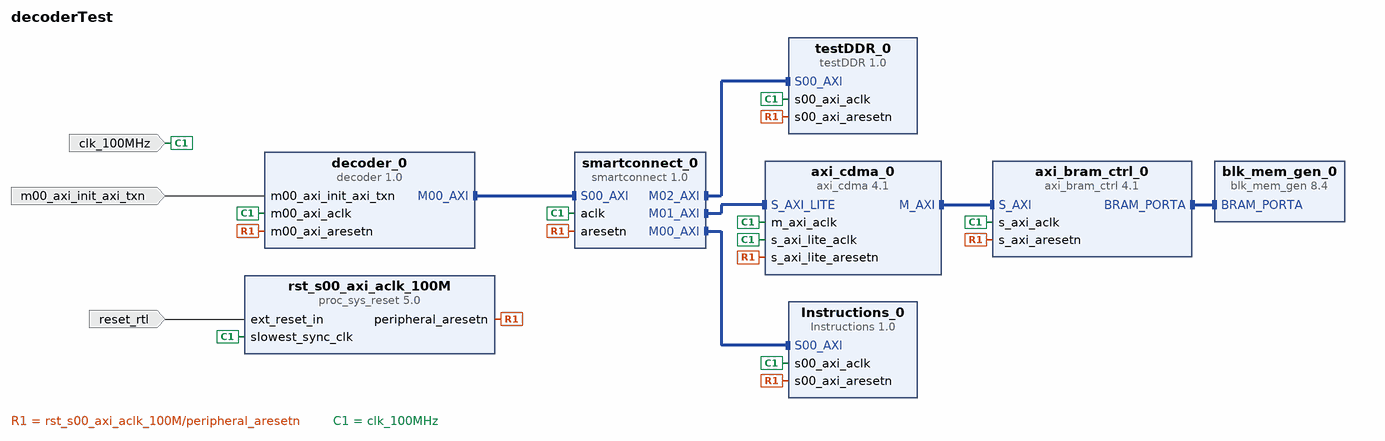
[diagram p0: block diagram of the top level]
# Vivado block design decoderTest, xc7z020clg400-1, Vivado 2018.3
create_bd_design decoderTest

create_bd_port -dir I -type rst reset_rtl
set_property -dict {CONFIG.POLARITY ACTIVE_LOW} [get_bd_ports reset_rtl]
create_bd_port -dir I m00_axi_init_axi_txn
create_bd_port -dir I -type clk clk_100MHz
set_property -dict {CONFIG.FREQ_HZ 100000000} [get_bd_ports clk_100MHz]

create_bd_cell -type ip -vlnv xilinx.com:ip:proc_sys_reset:5.0 rst_s00_axi_aclk_100M
create_bd_cell -type ip -vlnv xilinx.com:ip:axi_cdma:4.1 axi_cdma_0
set_property -dict {CONFIG.C_INCLUDE_SG 0} [get_bd_cells axi_cdma_0]
create_bd_cell -type ip -vlnv xilinx.com:ip:smartconnect:1.0 smartconnect_0
set_property -dict {CONFIG.NUM_MI 3 CONFIG.NUM_SI 1} [get_bd_cells smartconnect_0]
create_bd_cell -type ip -vlnv xilinx.com:ip:axi_bram_ctrl:4.1 axi_bram_ctrl_0
set_property -dict {CONFIG.SINGLE_PORT_BRAM 1} [get_bd_cells axi_bram_ctrl_0]
create_bd_cell -type ip -vlnv xilinx.com:ip:blk_mem_gen:8.4 blk_mem_gen_0
create_bd_cell -type ip -vlnv xilinx.com:user:Instructions:1.0 Instructions_0
create_bd_cell -type ip -vlnv xilinx.com:user:decoder:1.0 decoder_0
set_property -dict {CONFIG.C_M00_AXI_TRANSACTIONS_NUM 4} [get_bd_cells decoder_0]
create_bd_cell -type ip -vlnv xilinx.com:user:testDDR:1.0 testDDR_0

# ---- connections ----

connect_bd_intf_net [get_bd_intf_pins smartconnect_0/M02_AXI] [get_bd_intf_pins testDDR_0/S00_AXI]
connect_bd_intf_net [get_bd_intf_pins axi_bram_ctrl_0/BRAM_PORTA] [get_bd_intf_pins blk_mem_gen_0/BRAM_PORTA]
connect_bd_intf_net [get_bd_intf_pins decoder_0/M00_AXI] [get_bd_intf_pins smartconnect_0/S00_AXI]
connect_bd_intf_net [get_bd_intf_pins smartconnect_0/M00_AXI] [get_bd_intf_pins Instructions_0/S00_AXI]
connect_bd_intf_net [get_bd_intf_pins axi_cdma_0/M_AXI] [get_bd_intf_pins axi_bram_ctrl_0/S_AXI]
connect_bd_intf_net [get_bd_intf_pins axi_cdma_0/S_AXI_LITE] [get_bd_intf_pins smartconnect_0/M01_AXI]
connect_bd_net [get_bd_pins rst_s00_axi_aclk_100M/peripheral_aresetn] \
  [get_bd_pins axi_bram_ctrl_0/s_axi_aresetn] [get_bd_pins axi_cdma_0/s_axi_lite_aresetn] \
  [get_bd_pins smartconnect_0/aresetn] [get_bd_pins Instructions_0/s00_axi_aresetn] [get_bd_pins decoder_0/m00_axi_aresetn] \
  [get_bd_pins testDDR_0/s00_axi_aresetn]
connect_bd_net [get_bd_ports reset_rtl] [get_bd_pins rst_s00_axi_aclk_100M/ext_reset_in]
connect_bd_net [get_bd_ports m00_axi_init_axi_txn] [get_bd_pins decoder_0/m00_axi_init_axi_txn]
connect_bd_net [get_bd_ports clk_100MHz] \
  [get_bd_pins axi_bram_ctrl_0/s_axi_aclk] [get_bd_pins axi_cdma_0/m_axi_aclk] [get_bd_pins smartconnect_0/aclk] \
  [get_bd_pins axi_cdma_0/s_axi_lite_aclk] [get_bd_pins rst_s00_axi_aclk_100M/slowest_sync_clk] \
  [get_bd_pins Instructions_0/s00_axi_aclk] [get_bd_pins decoder_0/m00_axi_aclk] [get_bd_pins testDDR_0/s00_axi_aclk]

# ---- address map ----
assign_bd_address -offset 0xC0000000 -range 8K -target_address_space [get_bd_addr_spaces axi_cdma_0/Data] [get_bd_addr_segs axi_bram_ctrl_0/S_AXI/Mem0]
assign_bd_address -offset 0x40000000 -range 64K -target_address_space [get_bd_addr_spaces decoder_0/M00_AXI] [get_bd_addr_segs Instructions_0/S00_AXI/S00_AXI_reg]
assign_bd_address -offset 0x42000000 -range 64K -target_address_space [get_bd_addr_spaces decoder_0/M00_AXI] [get_bd_addr_segs axi_cdma_0/S_AXI_LITE/Reg]
assign_bd_address -offset 0x44A00000 -range 64K -target_address_space [get_bd_addr_spaces decoder_0/M00_AXI] [get_bd_addr_segs testDDR_0/S00_AXI/S00_AXI_reg]

validate_bd_design
save_bd_design
